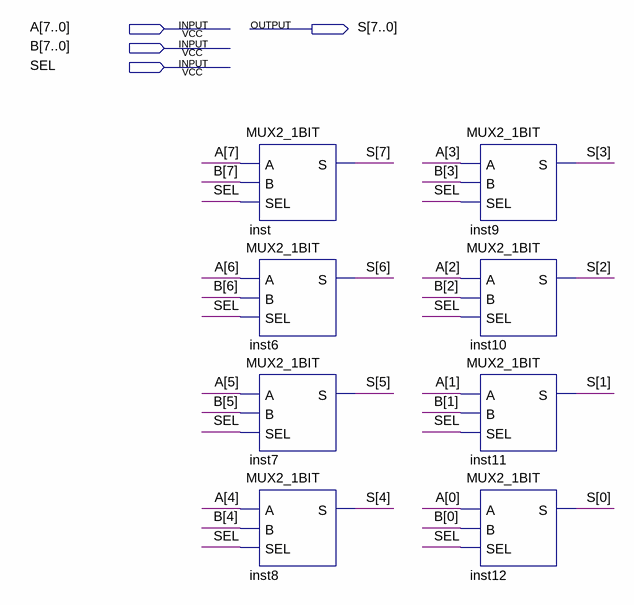
[diagram p0: schematic sheet]
// Quartus schematic MUX2_8BIT.bdf as structural Verilog: 8 symbols, 4 pins
module MUX2_8BIT (
  input  [7:0] A,
  input  [7:0] B,
  input  SEL,
  output [7:0] S
);

  MUX2_1BIT inst (.A(A[7]), .B(B[7]), .SEL(SEL), .S(S[7]));
  MUX2_1BIT inst6 (.A(A[6]), .B(B[6]), .SEL(SEL), .S(S[6]));
  MUX2_1BIT inst7 (.A(A[5]), .B(B[5]), .SEL(SEL), .S(S[5]));
  MUX2_1BIT inst8 (.A(A[4]), .B(B[4]), .SEL(SEL), .S(S[4]));
  MUX2_1BIT inst9 (.A(A[3]), .B(B[3]), .SEL(SEL), .S(S[3]));
  MUX2_1BIT inst10 (.A(A[2]), .B(B[2]), .SEL(SEL), .S(S[2]));
  MUX2_1BIT inst11 (.A(A[1]), .B(B[1]), .SEL(SEL), .S(S[1]));
  MUX2_1BIT inst12 (.A(A[0]), .B(B[0]), .SEL(SEL), .S(S[0]));
endmodule
